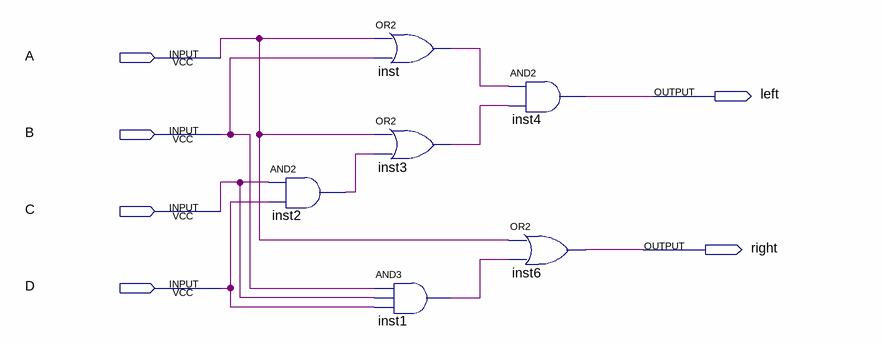
[diagram p0: schematic sheet]
// Quartus schematic LogicalEquation.bdf as structural Verilog: 6 symbols, 6 pins
module LogicalEquation (
  input  A,
  input  B,
  input  C,
  input  D,
  output left,
  output right
);

  wire inst1_out, inst2_out, inst3_out, inst_out;

  and inst2 (inst2_out, C, D);
  or inst (inst_out, A, B);
  or inst3 (inst3_out, A, inst2_out);
  and inst1 (inst1_out, B, C, D);
  and inst4 (left, inst_out, inst3_out);
  or inst6 (right, A, inst1_out);
endmodule
